# EAGLE design WT12 UART Mate Breakout Board v1.0 (EAGLE 5.11)
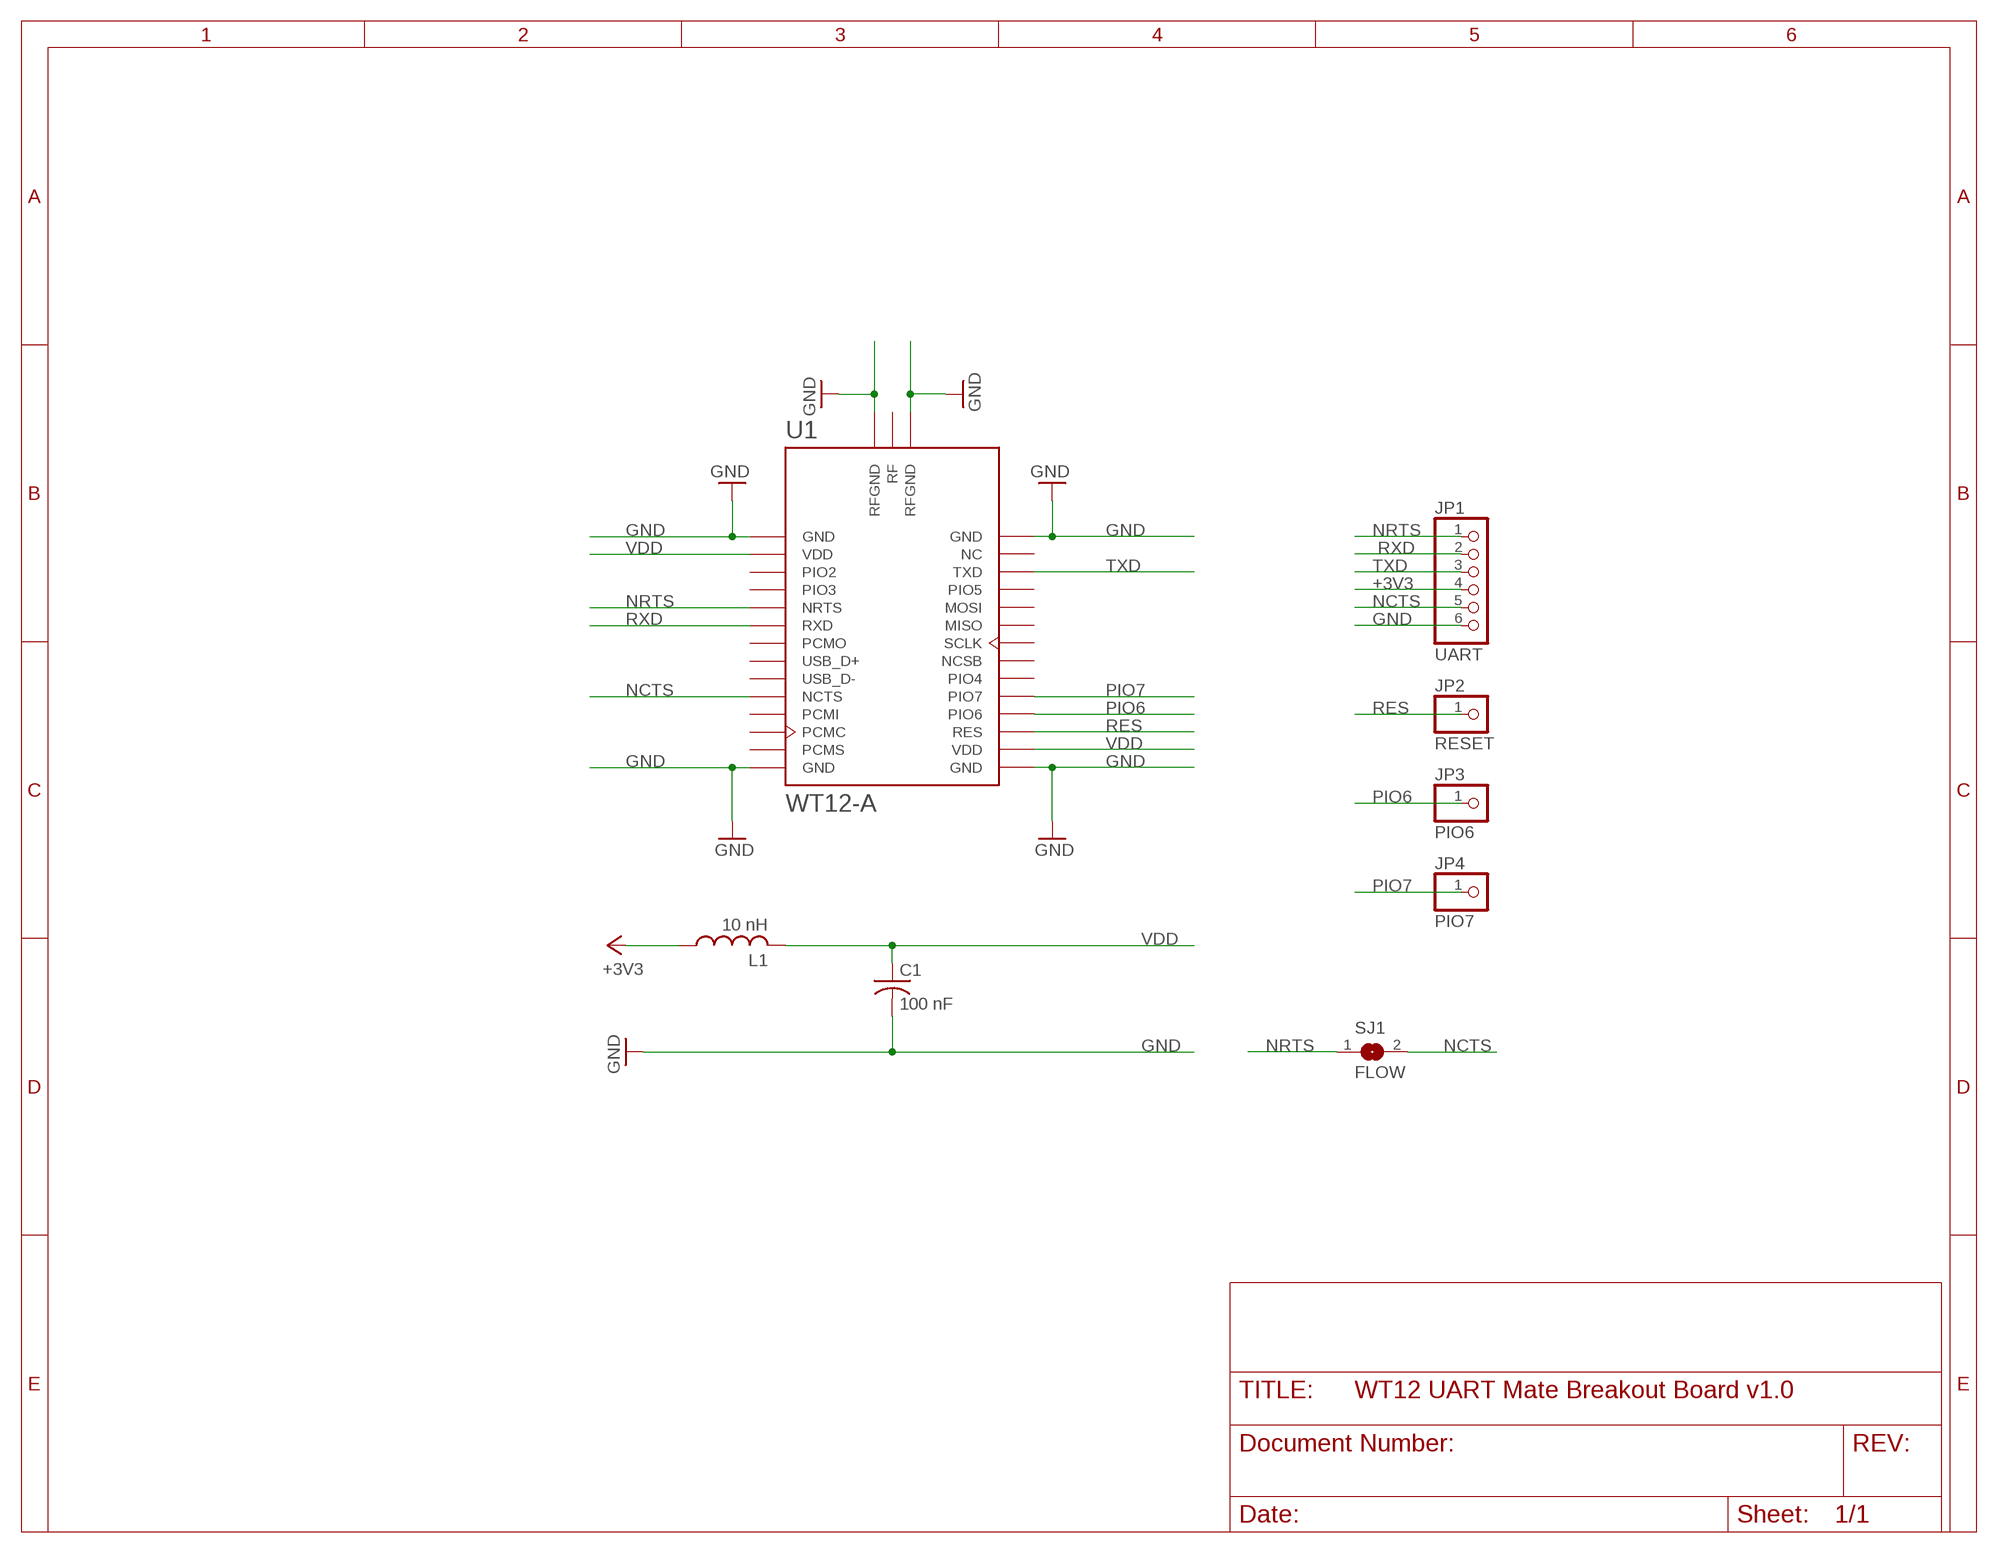
[diagram p0: schematic, sheet 1]

## Parts
C1  100 nF  C-USC0805  [C0805]
JP1  UART  PINHD-1X6  [1X06]
JP2  RESET  PINHD-1X1  [1X01]
JP3  PIO6  PINHD-1X1  [1X01]
JP4  PIO7  PINHD-1X1  [1X01]
L1  10 nH  L-USL2012C  [L2012C]
SJ1  FLOW  SJ  [SJ]
U1  WT12-A  WT12-A-VISUAL  [WT12-A]

## Nets
+3V3: JP1.4 L1.1
GND: C1.2 JP1.6 U1.GND1(GND) U1.GND2(GND) U1.GND3(GND) U1.GND4(GND) U1.RFGND1(RFGND) U1.RFGND2(RFGND)
NCTS: JP1.5 SJ1.2 U1.NCTS
NRTS: JP1.1 SJ1.1 U1.NRTS
PIO6: JP3.1 U1.PIO6
PIO7: JP4.1 U1.PIO7
RES: JP2.1 U1.RES
RXD: JP1.2 U1.RXD
TXD: JP1.3 U1.TXD
VDD: C1.1 L1.2 U1.VDD1(VDD) U1.VDD2(VDD)
Unconnected: U1.MISO U1.MOSI U1.NC U1.NCSB U1.PCMC U1.PCMI U1.PCMO U1.PCMS U1.PIO2 U1.PIO3 U1.PIO4 U1.PIO5 U1.RF U1.SCLK U1.USB_D+ U1.USB_D-

## Library data of the parts
C1 = resistor:C-US: CAPACITOR, American symbol
JP1 = sf-pinhead:PINHD-1X6: PIN HEADER
JP2-JP4 = sf-pinhead:PINHD-1X1: PIN HEADER
L1 = resistor:L-US: INDUCTOR, American symbol
SJ1 = jumper:SJ: SMD solder JUMPER
U1 = sf-bluegiga:WT12-A-VISUAL: Class 2 Bluetooth 2.1 + EDR module, chip antenna and RF pins

## Net classes
0 default: width 0.254 mm, drill 0.508 mm, clearance 0.254 mm

## Board
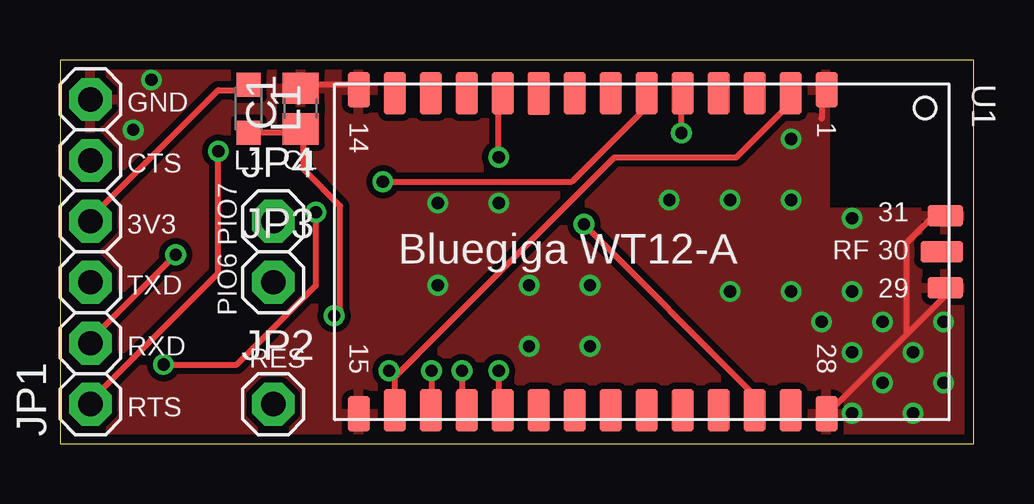
[diagram p1: board, top side]
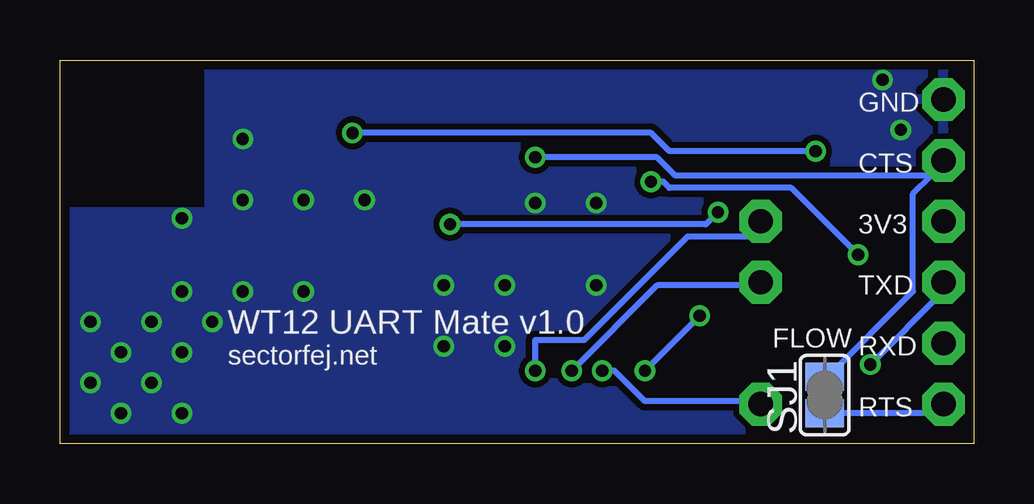
[diagram p2: board, bottom side, seen from below]

Size 38.1 x 15.99 mm. Coordinates in mm from the lower left corner, seen from the top.
Outline: 0,0 38.1,0 38.1,15.99 0,15.99 0,0
Copper layers (1*16): Top 0.0356mm / dielectric 1.5011mm / Bottom 0.0356mm
Design rules "LaenPCBOrder *": minimum track width 6mil, minimum drill 13mil, track to track 6mil, track to pad 6mil, pad to pad 6mil, via to via 6mil, smd to smd 6mil, copper to edge 15mil, drill to drill 6mil, minimum pad ring 7mil, minimum via ring 7mil, stop-mask expansion 4mil, vias tented up to drill 20mil, thermal gap 10mil
tRestrict: area 32.5,10 to 38.5,16.4
bRestrict: area 32.5,10 to 38.5,16.4

### Footprints (pad centres in the part's own frame; a part is rotated, then mirrored left to right if it is on the bottom)
C0805 = smd 1.3 x 1.5: 1 -0.85,0; 2 0.85,0
1X06 = drill 1.016 pad 1.778 octagon: 1 -6.35,0; 2 -3.81,0; 3 -1.27,0; 4 1.27,0; 5 3.81,0; 6 6.35,0
1X01 = drill 1.016 pad 1.778 octagon: 1 0,0
L2012C = smd 1 x 1: 1 -1,0; 2 1,0
SJ = smd 1.168 x 1.6: 1 -0.762,0; 2 0.762,0
WT12-A = smd 1.478 x 0.914: GND1 -6.75,7.7; GND2 -6.75,-11.8; GND3 6.75,-11.8; GND4 6.75,7.7 | smd 1.778 x 0.914: MISO 6.6,0.2; MOSI 6.6,1.7; NC 6.6,6.2; NCSB 6.6,-2.8; NCTS -6.6,-5.8; NRTS -6.6,1.7; PCMC -6.6,-8.8; PCMI -6.6,-7.3; PCMO -6.6,-1.3; PCMS -6.6,-10.3; PIO2 -6.6,4.7; PIO3 -6.6,3.2; PIO4 6.6,-4.3; PIO5 6.6,3.2; PIO6 6.6,-7.3; PIO7 6.6,-5.8; RES 6.6,-8.8; RXD -6.6,0.2; SCLK 6.6,-1.3; TXD 6.6,4.7; USB_D+ -6.6,-2.8; USB_D- -6.6,-4.3; VDD1 -6.6,6.2; VDD2 6.6,-10.3 | smd 0.914 x 1.778: RF 0,12.5 | smd 0.914 x 1.478: RFGND1 1.5,12.65; RFGND2 -1.5,12.65

### Placement (x,y rotation side)
C1  10.03,13.97 90 top
JP1  1.27,8 90 top
JP2  8.89,1.65 0 top
JP3  8.89,6.73 0 top
JP4  8.89,9.27 0 top
L1  7.87,13.97 270 top
SJ1  6.22,2.03 90 bottom
U1  24.26,8 270 top

### Tracks (layer width: path | path; a pad name or v marks a point on that pad's centre or on a via)
+3V3
  Top 0.254: L1.1 7.87,14.73 6.6,14.73 1.27,9.4 JP1.4
GND  (via drill 0.51)
  Top 0.254: 35.31,4.57 37.08,6.35 U1.RFGND1 | 35.31,4.57 32,1.27 U1.GND4 | 35.31,4.57 35.31,8.38 36.32,9.4 36.83,9.4 U1.RFGND2 | 32,14.73 U1.GND1 31.75,14.73 31.75,13.55 | C1.2 10.16,14.99 12.45,14.99 U1.GND2
  other vias: 33.02,1.27 35.56,1.27 36.83,2.54 36.83,5.08 35.56,3.81 34.29,2.54 33.02,3.81 34.29,5.08 33.02,6.35 31.75,5.08 30.48,6.35 27.94,6.35 27.94,10.16 33.02,9.4 30.48,10.16 30.48,12.7 25.4,10.16 18.29,10.03 15.75,10.03 15.75,6.6 3.81,15.16 3.05,13.08 19.56,6.6 22.1,6.6 22.1,4.06 19.56,4.06
  pour Bottom: 0,16 31.88,16 31.88,9.65 38.1,9.65 38.1,0 0,0
  pour Top: 0,16 31.88,16 31.88,9.65 38.1,9.65 38.1,0 0,0
NCTS  (via drill 0.51)
  Top 0.254: v18.29,11.94 18.29,14.48 U1.NCTS
  Bottom 0.254: 1.78,11.18 1.27,11.68 JP1.5 1.78,11.18 | 1.78,11.18 2.54,10.41 2.54,6.35 6.1,2.79 SJ1.2 | v18.29,11.94 13.21,11.94 12.45,11.18 1.78,11.18
NRTS  (via drill 0.51)
  Top 0.254: v25.91,12.95 25.91,14.48 U1.NRTS | v6.6,12.19 6.6,7.11 1.27,1.78 JP1.1
  Bottom 0.254: SJ1.1 1.52,1.27 1.27,1.52 JP1.1 | v25.91,12.95 13.46,12.95 12.7,12.19 v6.6,12.19
PIO6  (via drill 0.51)
  Top 0.254: v16.76,3.05 16.76,1.52 U1.PIO6
  Bottom 0.254: v16.76,3.05 13.21,6.6 8.89,6.6 JP3.1
PIO7  (via drill 0.51)
  Top 0.254: v18.29,3.05 18.29,1.52 U1.PIO7
  Bottom 0.254: v18.29,3.05 18.29,4.32 16.26,4.32 11.94,8.64 9.4,8.64 8.89,9.14 JP4.1
RES  (via drill 0.51)
  Top 0.254: v15.49,3.05 15.49,1.52 U1.RES
  Bottom 0.254: v15.49,3.05 14.99,3.05 13.72,1.78 8.89,1.78 JP2.1
RXD  (via drill 0.51)
  Top 0.254: v13.46,10.92 21.34,10.92 24.38,13.97 24.38,14.48 U1.RXD | v4.83,7.87 1.27,4.32 JP1.2
  Bottom 0.254: v13.46,10.92 12.95,10.92 12.7,10.67 7.62,10.67 v4.83,7.87
TXD  (via drill 0.51)
  Top 0.254: v21.84,9.14 28.96,2.03 28.96,1.52 U1.TXD | v10.67,9.65 10.67,6.6 7.37,3.3 v4.32,3.3
  Bottom 0.254: v21.84,9.14 11.18,9.14 v10.67,9.65 | v4.32,3.3 1.27,6.35 JP1.3
VDD  (via drill 0.51)
  Top 0.254: L1.2 7.87,12.95 9.91,12.95 C1.1 10.16,12.95 10.16,11.43 11.68,9.91 11.68,5.59 v11.43,5.33 | 13.97,2.79 13.97,1.52 U1.VDD2 | 13.97,2.79 23.11,11.94 28.19,11.94 30.23,13.97 30.23,14.48 U1.VDD1 | 13.97,2.79 v13.72,3.05
  Bottom 0.254: v13.72,3.05 v11.43,5.33

### Text on the board
tPlace: GND | CTS | L1 | C1 | 3V3 | PIO7 | Bluegiga WT12-A | TXD | PIO6 | RXD | RES | RTS
bPlace: GND | CTS | 3V3 | TXD | FLOW | WT12 UART Mate v1.0 | RXD | sectorfej.net | RTS